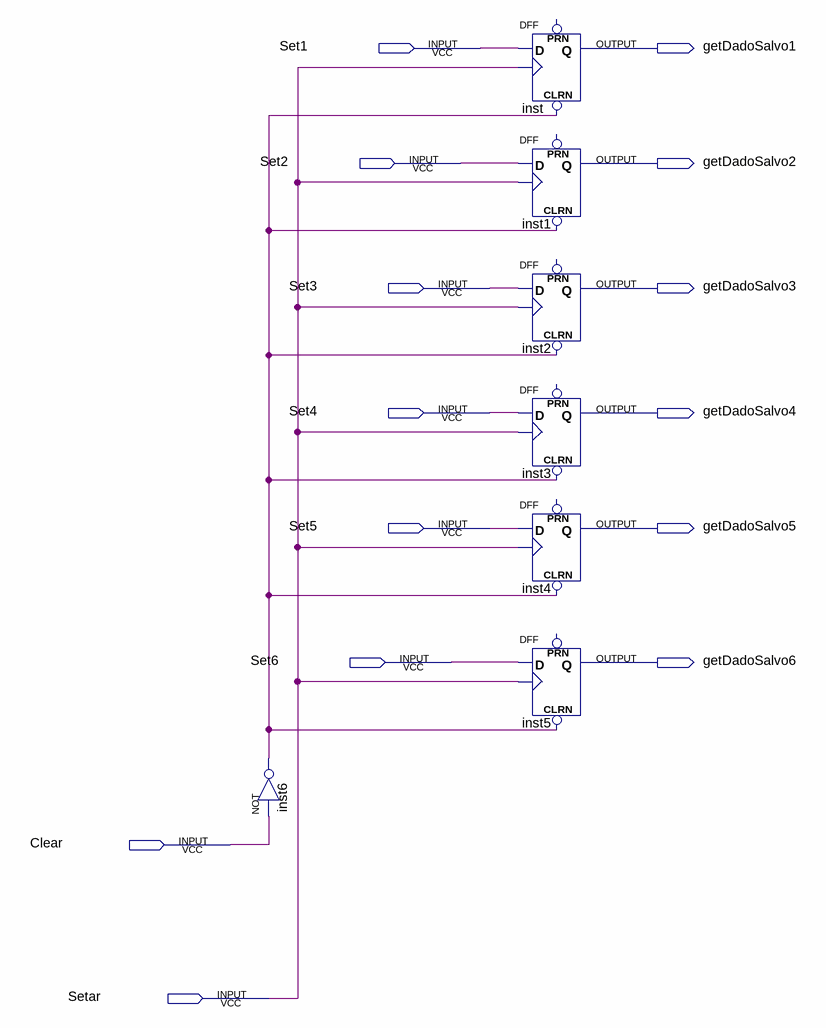
[diagram p0: schematic sheet]
// Quartus schematic ArmazenamentoDe6bits.bdf as structural Verilog: 7 symbols, 14 pins
module ArmazenamentoDe6bits (
  input  Set1,
  input  Set2,
  input  Set3,
  input  Set4,
  input  Set5,
  input  Set6,
  input  Clear,
  input  Setar,
  output getDadoSalvo1,
  output getDadoSalvo2,
  output getDadoSalvo3,
  output getDadoSalvo4,
  output getDadoSalvo5,
  output getDadoSalvo6
);

  wire inst6_out;

  not inst6 (inst6_out, Clear);
  DFF inst (.CLRN(inst6_out), .CLK(Setar), .D(Set1), .Q(getDadoSalvo1));  // open: PRN
  DFF inst1 (.CLRN(inst6_out), .CLK(Setar), .D(Set2), .Q(getDadoSalvo2));  // open: PRN
  DFF inst2 (.CLRN(inst6_out), .CLK(Setar), .D(Set3), .Q(getDadoSalvo3));  // open: PRN
  DFF inst3 (.CLRN(inst6_out), .CLK(Setar), .D(Set4), .Q(getDadoSalvo4));  // open: PRN
  DFF inst4 (.CLRN(inst6_out), .CLK(Setar), .D(Set5), .Q(getDadoSalvo5));  // open: PRN
  DFF inst5 (.CLRN(inst6_out), .CLK(Setar), .D(Set6), .Q(getDadoSalvo6));  // open: PRN
endmodule
